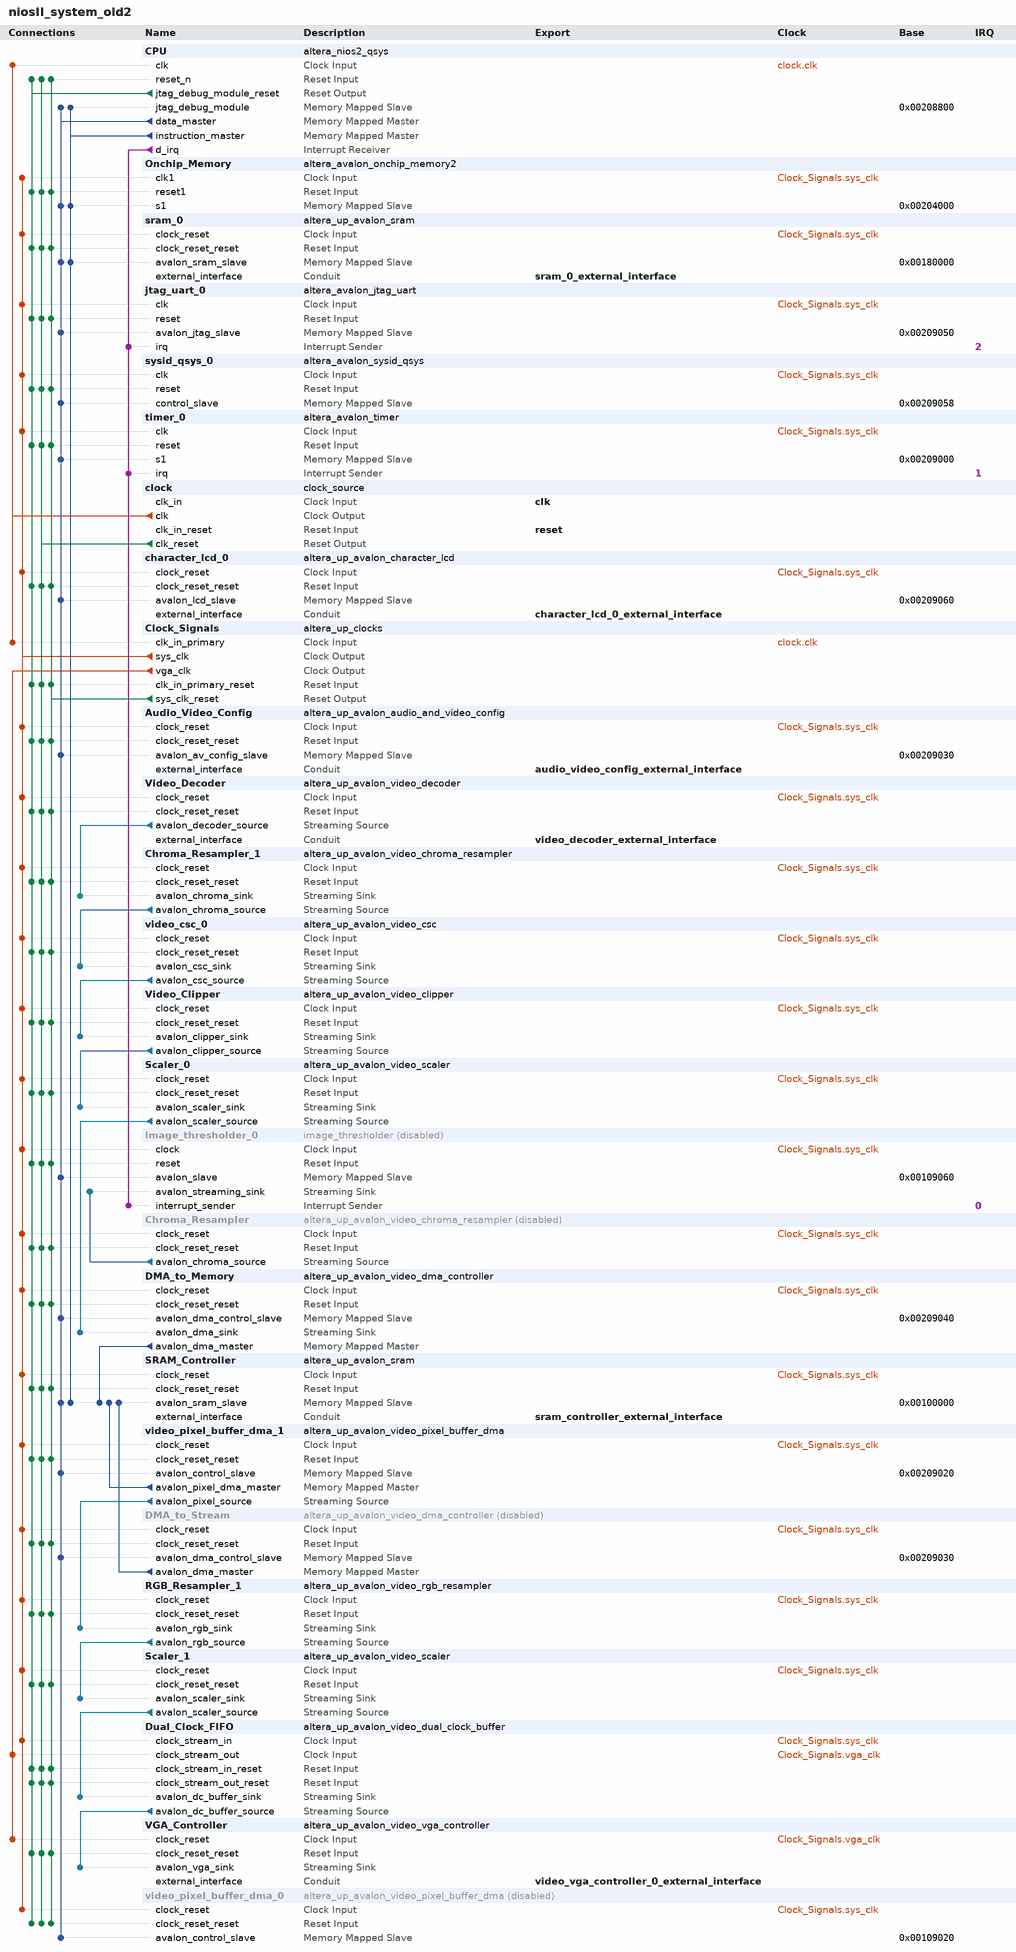
[diagram p0: system contents]
# Platform Designer (Qsys) system niosII_system_old2, Cyclone II EP2C35F672C6
# Parameters at their usual value, and those the tool derives, are not listed.
package require -exact qsys 12.0
create_system niosII_system_old2
set_project_property DEVICE_FAMILY {Cyclone II}
set_project_property DEVICE EP2C35F672C6

add_instance CPU altera_nios2_qsys 12.1
set_instance_parameter_value CPU resetSlave Onchip_Memory.s1
set_instance_parameter_value CPU exceptionSlave Onchip_Memory.s1
set_instance_parameter_value CPU breakSlave CPU.jtag_debug_module
set_instance_parameter_value CPU impl Tiny
set_instance_parameter_value CPU icache_size 4096

add_instance Onchip_Memory altera_avalon_onchip_memory2 12.1
set_instance_parameter_value Onchip_Memory dataWidth 32
set_instance_parameter_value Onchip_Memory dualPort false
set_instance_parameter_value Onchip_Memory initMemContent true
set_instance_parameter_value Onchip_Memory initializationFileName Onchip_Memory
set_instance_parameter_value Onchip_Memory memorySize 16384

add_instance sram_0 altera_up_avalon_sram 12.0
set_instance_parameter_value sram_0 board DE2
set_instance_parameter_value sram_0 pixel_buffer false

add_instance jtag_uart_0 altera_avalon_jtag_uart 12.1
set_instance_parameter_value jtag_uart_0 simInteractiveOptions INTERACTIVE_ASCII_OUTPUT

add_instance sysid_qsys_0 altera_avalon_sysid_qsys 12.1
set_instance_parameter_value sysid_qsys_0 id 1164128856

add_instance timer_0 altera_avalon_timer 12.1
set_instance_parameter_value timer_0 period 1
set_instance_parameter_value timer_0 periodUnits MSEC
set_instance_parameter_value timer_0 timerPreset CUSTOM

add_instance clock clock_source 12.1
set_instance_parameter_value clock clockFrequency 50000000

add_instance character_lcd_0 altera_up_avalon_character_lcd 12.0
set_instance_parameter_value character_lcd_0 cursor Normal

add_instance Clock_Signals altera_up_clocks 12.0
set_instance_parameter_value Clock_Signals board DE2
set_instance_parameter_value Clock_Signals sdram_clk false
set_instance_parameter_value Clock_Signals vga_clk true
set_instance_parameter_value Clock_Signals audio_clk false
set_instance_parameter_value Clock_Signals audio_clk_freq 12.288

add_instance Audio_Video_Config altera_up_avalon_audio_and_video_config 12.0
set_instance_parameter_value Audio_Video_Config board DE2
set_instance_parameter_value Audio_Video_Config audio_in {Microphone to ADC}
set_instance_parameter_value Audio_Video_Config line_in_bypass false
set_instance_parameter_value Audio_Video_Config bit_length 24
set_instance_parameter_value Audio_Video_Config sampling_rate {48 kHz}

add_instance Video_Decoder altera_up_avalon_video_decoder 12.0

add_instance Chroma_Resampler_1 altera_up_avalon_video_chroma_resampler 12.0

add_instance video_csc_0 altera_up_avalon_video_csc 12.0

add_instance Video_Clipper altera_up_avalon_video_clipper 12.0
set_instance_parameter_value Video_Clipper color_bits 8
set_instance_parameter_value Video_Clipper color_planes 3

add_instance Scaler_0 altera_up_avalon_video_scaler 12.0
set_instance_parameter_value Scaler_0 width_scaling 0.5
set_instance_parameter_value Scaler_0 height_scaling 1
set_instance_parameter_value Scaler_0 width_in 640
set_instance_parameter_value Scaler_0 color_bits 8
set_instance_parameter_value Scaler_0 color_planes 3

add_instance image_thresholder_0 image_thresholder 1.0
set_instance_property image_thresholder_0 ENABLED false
set_instance_parameter_value image_thresholder_0 IW 7

add_instance Chroma_Resampler altera_up_avalon_video_chroma_resampler 12.0
set_instance_property Chroma_Resampler ENABLED false

add_instance DMA_to_Memory altera_up_avalon_video_dma_controller 12.0
set_instance_parameter_value DMA_to_Memory mode {From Stream to Memory}
set_instance_parameter_value DMA_to_Memory addr_mode X-Y
set_instance_parameter_value DMA_to_Memory start_address 0
set_instance_parameter_value DMA_to_Memory back_start_address 0
set_instance_parameter_value DMA_to_Memory width 320
set_instance_parameter_value DMA_to_Memory height 240
set_instance_parameter_value DMA_to_Memory color_bits 8
set_instance_parameter_value DMA_to_Memory color_planes 3

add_instance SRAM_Controller altera_up_avalon_sram 12.0
set_instance_parameter_value SRAM_Controller board DE2
set_instance_parameter_value SRAM_Controller pixel_buffer true

add_instance video_pixel_buffer_dma_1 altera_up_avalon_video_pixel_buffer_dma 12.0
set_instance_parameter_value video_pixel_buffer_dma_1 addr_mode X-Y
set_instance_parameter_value video_pixel_buffer_dma_1 start_address 0
set_instance_parameter_value video_pixel_buffer_dma_1 back_start_address 0
set_instance_parameter_value video_pixel_buffer_dma_1 image_width 320
set_instance_parameter_value video_pixel_buffer_dma_1 image_height 240
set_instance_parameter_value video_pixel_buffer_dma_1 color_space {24-bit RGB}

add_instance DMA_to_Stream altera_up_avalon_video_dma_controller 12.0
set_instance_property DMA_to_Stream ENABLED false
set_instance_parameter_value DMA_to_Stream mode {From Memory to Stream}
set_instance_parameter_value DMA_to_Stream addr_mode X-Y
set_instance_parameter_value DMA_to_Stream start_address 0
set_instance_parameter_value DMA_to_Stream back_start_address 0
set_instance_parameter_value DMA_to_Stream width 320
set_instance_parameter_value DMA_to_Stream height 240
set_instance_parameter_value DMA_to_Stream color_bits 8
set_instance_parameter_value DMA_to_Stream color_planes 3

add_instance RGB_Resampler_1 altera_up_avalon_video_rgb_resampler 12.0
set_instance_parameter_value RGB_Resampler_1 input_type {24-bit RGB}
set_instance_parameter_value RGB_Resampler_1 output_type {30-bit RGB}
set_instance_parameter_value RGB_Resampler_1 alpha 1023

add_instance Scaler_1 altera_up_avalon_video_scaler 12.0
set_instance_parameter_value Scaler_1 width_scaling 2
set_instance_parameter_value Scaler_1 height_scaling 2
set_instance_parameter_value Scaler_1 width_in 320
set_instance_parameter_value Scaler_1 color_bits 10
set_instance_parameter_value Scaler_1 color_planes 3

add_instance Dual_Clock_FIFO altera_up_avalon_video_dual_clock_buffer 12.0
set_instance_parameter_value Dual_Clock_FIFO color_bits 10

add_instance VGA_Controller altera_up_avalon_video_vga_controller 12.0
set_instance_parameter_value VGA_Controller board DE2

add_instance video_pixel_buffer_dma_0 altera_up_avalon_video_pixel_buffer_dma 12.0
set_instance_property video_pixel_buffer_dma_0 ENABLED false
set_instance_parameter_value video_pixel_buffer_dma_0 addr_mode X-Y
set_instance_parameter_value video_pixel_buffer_dma_0 start_address 0
set_instance_parameter_value video_pixel_buffer_dma_0 back_start_address 0
set_instance_parameter_value video_pixel_buffer_dma_0 image_width 320
set_instance_parameter_value video_pixel_buffer_dma_0 image_height 240
set_instance_parameter_value video_pixel_buffer_dma_0 color_space {24-bit RGB}

# connections
add_connection clock.clk Clock_Signals.clk_in_primary clock
add_connection clock.clk CPU.clk clock
add_connection Clock_Signals.sys_clk Audio_Video_Config.clock_reset clock
add_connection Clock_Signals.sys_clk character_lcd_0.clock_reset clock
add_connection Clock_Signals.sys_clk Chroma_Resampler.clock_reset clock
add_connection Clock_Signals.sys_clk Chroma_Resampler_1.clock_reset clock
add_connection Clock_Signals.sys_clk DMA_to_Memory.clock_reset clock
add_connection Clock_Signals.sys_clk DMA_to_Stream.clock_reset clock
add_connection Clock_Signals.sys_clk Dual_Clock_FIFO.clock_stream_in clock
add_connection Clock_Signals.sys_clk image_thresholder_0.clock clock
add_connection Clock_Signals.sys_clk jtag_uart_0.clk clock
add_connection Clock_Signals.sys_clk Onchip_Memory.clk1 clock
add_connection Clock_Signals.sys_clk RGB_Resampler_1.clock_reset clock
add_connection Clock_Signals.sys_clk Scaler_0.clock_reset clock
add_connection Clock_Signals.sys_clk Scaler_1.clock_reset clock
add_connection Clock_Signals.sys_clk sram_0.clock_reset clock
add_connection Clock_Signals.sys_clk SRAM_Controller.clock_reset clock
add_connection Clock_Signals.sys_clk sysid_qsys_0.clk clock
add_connection Clock_Signals.sys_clk timer_0.clk clock
add_connection Clock_Signals.sys_clk Video_Clipper.clock_reset clock
add_connection Clock_Signals.sys_clk video_csc_0.clock_reset clock
add_connection Clock_Signals.sys_clk Video_Decoder.clock_reset clock
add_connection Clock_Signals.sys_clk video_pixel_buffer_dma_0.clock_reset clock
add_connection Clock_Signals.sys_clk video_pixel_buffer_dma_1.clock_reset clock
add_connection Clock_Signals.vga_clk Dual_Clock_FIFO.clock_stream_out clock
add_connection Clock_Signals.vga_clk VGA_Controller.clock_reset clock
add_connection clock.clk_reset Audio_Video_Config.clock_reset_reset reset
add_connection clock.clk_reset character_lcd_0.clock_reset_reset reset
add_connection clock.clk_reset Chroma_Resampler.clock_reset_reset reset
add_connection clock.clk_reset Chroma_Resampler_1.clock_reset_reset reset
add_connection clock.clk_reset Clock_Signals.clk_in_primary_reset reset
add_connection clock.clk_reset CPU.reset_n reset
add_connection clock.clk_reset DMA_to_Memory.clock_reset_reset reset
add_connection clock.clk_reset DMA_to_Stream.clock_reset_reset reset
add_connection clock.clk_reset Dual_Clock_FIFO.clock_stream_in_reset reset
add_connection clock.clk_reset Dual_Clock_FIFO.clock_stream_out_reset reset
add_connection clock.clk_reset image_thresholder_0.reset reset
add_connection clock.clk_reset jtag_uart_0.reset reset
add_connection clock.clk_reset Onchip_Memory.reset1 reset
add_connection clock.clk_reset RGB_Resampler_1.clock_reset_reset reset
add_connection clock.clk_reset Scaler_0.clock_reset_reset reset
add_connection clock.clk_reset Scaler_1.clock_reset_reset reset
add_connection clock.clk_reset sram_0.clock_reset_reset reset
add_connection clock.clk_reset SRAM_Controller.clock_reset_reset reset
add_connection clock.clk_reset sysid_qsys_0.reset reset
add_connection clock.clk_reset timer_0.reset reset
add_connection clock.clk_reset VGA_Controller.clock_reset_reset reset
add_connection clock.clk_reset Video_Clipper.clock_reset_reset reset
add_connection clock.clk_reset video_csc_0.clock_reset_reset reset
add_connection clock.clk_reset Video_Decoder.clock_reset_reset reset
add_connection clock.clk_reset video_pixel_buffer_dma_0.clock_reset_reset reset
add_connection clock.clk_reset video_pixel_buffer_dma_1.clock_reset_reset reset
add_connection Clock_Signals.sys_clk_reset Audio_Video_Config.clock_reset_reset reset
add_connection Clock_Signals.sys_clk_reset character_lcd_0.clock_reset_reset reset
add_connection Clock_Signals.sys_clk_reset Chroma_Resampler.clock_reset_reset reset
add_connection Clock_Signals.sys_clk_reset Chroma_Resampler_1.clock_reset_reset reset
add_connection Clock_Signals.sys_clk_reset Clock_Signals.clk_in_primary_reset reset
add_connection Clock_Signals.sys_clk_reset CPU.reset_n reset
add_connection Clock_Signals.sys_clk_reset DMA_to_Memory.clock_reset_reset reset
add_connection Clock_Signals.sys_clk_reset DMA_to_Stream.clock_reset_reset reset
add_connection Clock_Signals.sys_clk_reset Dual_Clock_FIFO.clock_stream_in_reset reset
add_connection Clock_Signals.sys_clk_reset Dual_Clock_FIFO.clock_stream_out_reset reset
add_connection Clock_Signals.sys_clk_reset image_thresholder_0.reset reset
add_connection Clock_Signals.sys_clk_reset jtag_uart_0.reset reset
add_connection Clock_Signals.sys_clk_reset Onchip_Memory.reset1 reset
add_connection Clock_Signals.sys_clk_reset RGB_Resampler_1.clock_reset_reset reset
add_connection Clock_Signals.sys_clk_reset Scaler_0.clock_reset_reset reset
add_connection Clock_Signals.sys_clk_reset Scaler_1.clock_reset_reset reset
add_connection Clock_Signals.sys_clk_reset sram_0.clock_reset_reset reset
add_connection Clock_Signals.sys_clk_reset SRAM_Controller.clock_reset_reset reset
add_connection Clock_Signals.sys_clk_reset sysid_qsys_0.reset reset
add_connection Clock_Signals.sys_clk_reset timer_0.reset reset
add_connection Clock_Signals.sys_clk_reset VGA_Controller.clock_reset_reset reset
add_connection Clock_Signals.sys_clk_reset Video_Clipper.clock_reset_reset reset
add_connection Clock_Signals.sys_clk_reset video_csc_0.clock_reset_reset reset
add_connection Clock_Signals.sys_clk_reset Video_Decoder.clock_reset_reset reset
add_connection Clock_Signals.sys_clk_reset video_pixel_buffer_dma_0.clock_reset_reset reset
add_connection Clock_Signals.sys_clk_reset video_pixel_buffer_dma_1.clock_reset_reset reset
add_connection CPU.jtag_debug_module_reset Audio_Video_Config.clock_reset_reset reset
add_connection CPU.jtag_debug_module_reset character_lcd_0.clock_reset_reset reset
add_connection CPU.jtag_debug_module_reset Chroma_Resampler.clock_reset_reset reset
add_connection CPU.jtag_debug_module_reset Chroma_Resampler_1.clock_reset_reset reset
add_connection CPU.jtag_debug_module_reset Clock_Signals.clk_in_primary_reset reset
add_connection CPU.jtag_debug_module_reset CPU.reset_n reset
add_connection CPU.jtag_debug_module_reset DMA_to_Memory.clock_reset_reset reset
add_connection CPU.jtag_debug_module_reset DMA_to_Stream.clock_reset_reset reset
add_connection CPU.jtag_debug_module_reset Dual_Clock_FIFO.clock_stream_in_reset reset
add_connection CPU.jtag_debug_module_reset Dual_Clock_FIFO.clock_stream_out_reset reset
add_connection CPU.jtag_debug_module_reset image_thresholder_0.reset reset
add_connection CPU.jtag_debug_module_reset jtag_uart_0.reset reset
add_connection CPU.jtag_debug_module_reset Onchip_Memory.reset1 reset
add_connection CPU.jtag_debug_module_reset RGB_Resampler_1.clock_reset_reset reset
add_connection CPU.jtag_debug_module_reset Scaler_0.clock_reset_reset reset
add_connection CPU.jtag_debug_module_reset Scaler_1.clock_reset_reset reset
add_connection CPU.jtag_debug_module_reset sram_0.clock_reset_reset reset
add_connection CPU.jtag_debug_module_reset SRAM_Controller.clock_reset_reset reset
add_connection CPU.jtag_debug_module_reset sysid_qsys_0.reset reset
add_connection CPU.jtag_debug_module_reset timer_0.reset reset
add_connection CPU.jtag_debug_module_reset VGA_Controller.clock_reset_reset reset
add_connection CPU.jtag_debug_module_reset Video_Clipper.clock_reset_reset reset
add_connection CPU.jtag_debug_module_reset video_csc_0.clock_reset_reset reset
add_connection CPU.jtag_debug_module_reset Video_Decoder.clock_reset_reset reset
add_connection CPU.jtag_debug_module_reset video_pixel_buffer_dma_0.clock_reset_reset reset
add_connection CPU.jtag_debug_module_reset video_pixel_buffer_dma_1.clock_reset_reset reset
add_connection CPU.data_master Audio_Video_Config.avalon_av_config_slave avalon
set_connection_parameter_value CPU.data_master/Audio_Video_Config.avalon_av_config_slave baseAddress 0x00209030
add_connection CPU.data_master character_lcd_0.avalon_lcd_slave avalon
set_connection_parameter_value CPU.data_master/character_lcd_0.avalon_lcd_slave baseAddress 0x00209060
add_connection CPU.data_master CPU.jtag_debug_module avalon
set_connection_parameter_value CPU.data_master/CPU.jtag_debug_module baseAddress 0x00208800
add_connection CPU.data_master DMA_to_Memory.avalon_dma_control_slave avalon
set_connection_parameter_value CPU.data_master/DMA_to_Memory.avalon_dma_control_slave baseAddress 0x00209040
add_connection CPU.data_master DMA_to_Stream.avalon_dma_control_slave avalon
set_connection_parameter_value CPU.data_master/DMA_to_Stream.avalon_dma_control_slave baseAddress 0x00209030
add_connection CPU.data_master image_thresholder_0.avalon_slave avalon
set_connection_parameter_value CPU.data_master/image_thresholder_0.avalon_slave baseAddress 0x00109060
add_connection CPU.data_master jtag_uart_0.avalon_jtag_slave avalon
set_connection_parameter_value CPU.data_master/jtag_uart_0.avalon_jtag_slave baseAddress 0x00209050
add_connection CPU.data_master Onchip_Memory.s1 avalon
set_connection_parameter_value CPU.data_master/Onchip_Memory.s1 baseAddress 0x00204000
add_connection CPU.data_master sram_0.avalon_sram_slave avalon
set_connection_parameter_value CPU.data_master/sram_0.avalon_sram_slave baseAddress 0x00180000
add_connection CPU.data_master SRAM_Controller.avalon_sram_slave avalon
set_connection_parameter_value CPU.data_master/SRAM_Controller.avalon_sram_slave baseAddress 0x00100000
add_connection CPU.data_master sysid_qsys_0.control_slave avalon
set_connection_parameter_value CPU.data_master/sysid_qsys_0.control_slave baseAddress 0x00209058
add_connection CPU.data_master timer_0.s1 avalon
set_connection_parameter_value CPU.data_master/timer_0.s1 baseAddress 0x00209000
add_connection CPU.data_master video_pixel_buffer_dma_0.avalon_control_slave avalon
set_connection_parameter_value CPU.data_master/video_pixel_buffer_dma_0.avalon_control_slave baseAddress 0x00109020
add_connection CPU.data_master video_pixel_buffer_dma_1.avalon_control_slave avalon
set_connection_parameter_value CPU.data_master/video_pixel_buffer_dma_1.avalon_control_slave baseAddress 0x00209020
add_connection CPU.instruction_master CPU.jtag_debug_module avalon
set_connection_parameter_value CPU.instruction_master/CPU.jtag_debug_module baseAddress 0x00208800
add_connection CPU.instruction_master Onchip_Memory.s1 avalon
set_connection_parameter_value CPU.instruction_master/Onchip_Memory.s1 baseAddress 0x00204000
add_connection CPU.instruction_master sram_0.avalon_sram_slave avalon
set_connection_parameter_value CPU.instruction_master/sram_0.avalon_sram_slave baseAddress 0x00180000
add_connection CPU.instruction_master SRAM_Controller.avalon_sram_slave avalon
set_connection_parameter_value CPU.instruction_master/SRAM_Controller.avalon_sram_slave baseAddress 0x00100000
add_connection DMA_to_Memory.avalon_dma_master SRAM_Controller.avalon_sram_slave avalon
set_connection_parameter_value DMA_to_Memory.avalon_dma_master/SRAM_Controller.avalon_sram_slave baseAddress 0x00100000
add_connection DMA_to_Stream.avalon_dma_master SRAM_Controller.avalon_sram_slave avalon
set_connection_parameter_value DMA_to_Stream.avalon_dma_master/SRAM_Controller.avalon_sram_slave baseAddress 0x00100000
add_connection video_pixel_buffer_dma_1.avalon_pixel_dma_master SRAM_Controller.avalon_sram_slave avalon
set_connection_parameter_value video_pixel_buffer_dma_1.avalon_pixel_dma_master/SRAM_Controller.avalon_sram_slave baseAddress 0x00100000
add_connection Chroma_Resampler.avalon_chroma_source image_thresholder_0.avalon_streaming_sink avalon_streaming
add_connection Chroma_Resampler_1.avalon_chroma_source video_csc_0.avalon_csc_sink avalon_streaming
add_connection Dual_Clock_FIFO.avalon_dc_buffer_source VGA_Controller.avalon_vga_sink avalon_streaming
add_connection RGB_Resampler_1.avalon_rgb_source Scaler_1.avalon_scaler_sink avalon_streaming
add_connection Scaler_0.avalon_scaler_source DMA_to_Memory.avalon_dma_sink avalon_streaming
add_connection Scaler_1.avalon_scaler_source Dual_Clock_FIFO.avalon_dc_buffer_sink avalon_streaming
add_connection Video_Clipper.avalon_clipper_source Scaler_0.avalon_scaler_sink avalon_streaming
add_connection video_csc_0.avalon_csc_source Video_Clipper.avalon_clipper_sink avalon_streaming
add_connection Video_Decoder.avalon_decoder_source Chroma_Resampler_1.avalon_chroma_sink avalon_streaming
add_connection video_pixel_buffer_dma_1.avalon_pixel_source RGB_Resampler_1.avalon_rgb_sink avalon_streaming
add_connection CPU.d_irq image_thresholder_0.interrupt_sender interrupt
set_connection_parameter_value CPU.d_irq/image_thresholder_0.interrupt_sender irqNumber 0
add_connection CPU.d_irq jtag_uart_0.irq interrupt
set_connection_parameter_value CPU.d_irq/jtag_uart_0.irq irqNumber 2
add_connection CPU.d_irq timer_0.irq interrupt
set_connection_parameter_value CPU.d_irq/timer_0.irq irqNumber 1

# exported interfaces
add_interface clk clock sink
set_interface_property clk EXPORT_OF clock.clk_in
add_interface reset reset sink
set_interface_property reset EXPORT_OF clock.clk_in_reset
add_interface video_decoder_external_interface conduit end
set_interface_property video_decoder_external_interface EXPORT_OF Video_Decoder.external_interface
add_interface sram_controller_external_interface conduit end
set_interface_property sram_controller_external_interface EXPORT_OF SRAM_Controller.external_interface
add_interface video_vga_controller_0_external_interface conduit end
set_interface_property video_vga_controller_0_external_interface EXPORT_OF VGA_Controller.external_interface
add_interface audio_video_config_external_interface conduit end
set_interface_property audio_video_config_external_interface EXPORT_OF Audio_Video_Config.external_interface
add_interface sram_0_external_interface conduit end
set_interface_property sram_0_external_interface EXPORT_OF sram_0.external_interface
add_interface character_lcd_0_external_interface conduit end
set_interface_property character_lcd_0_external_interface EXPORT_OF character_lcd_0.external_interface

save_system niosII_system_old2.qsys
